# EAGLE schematic out8x8_2 (EAGLE 9.6.2)
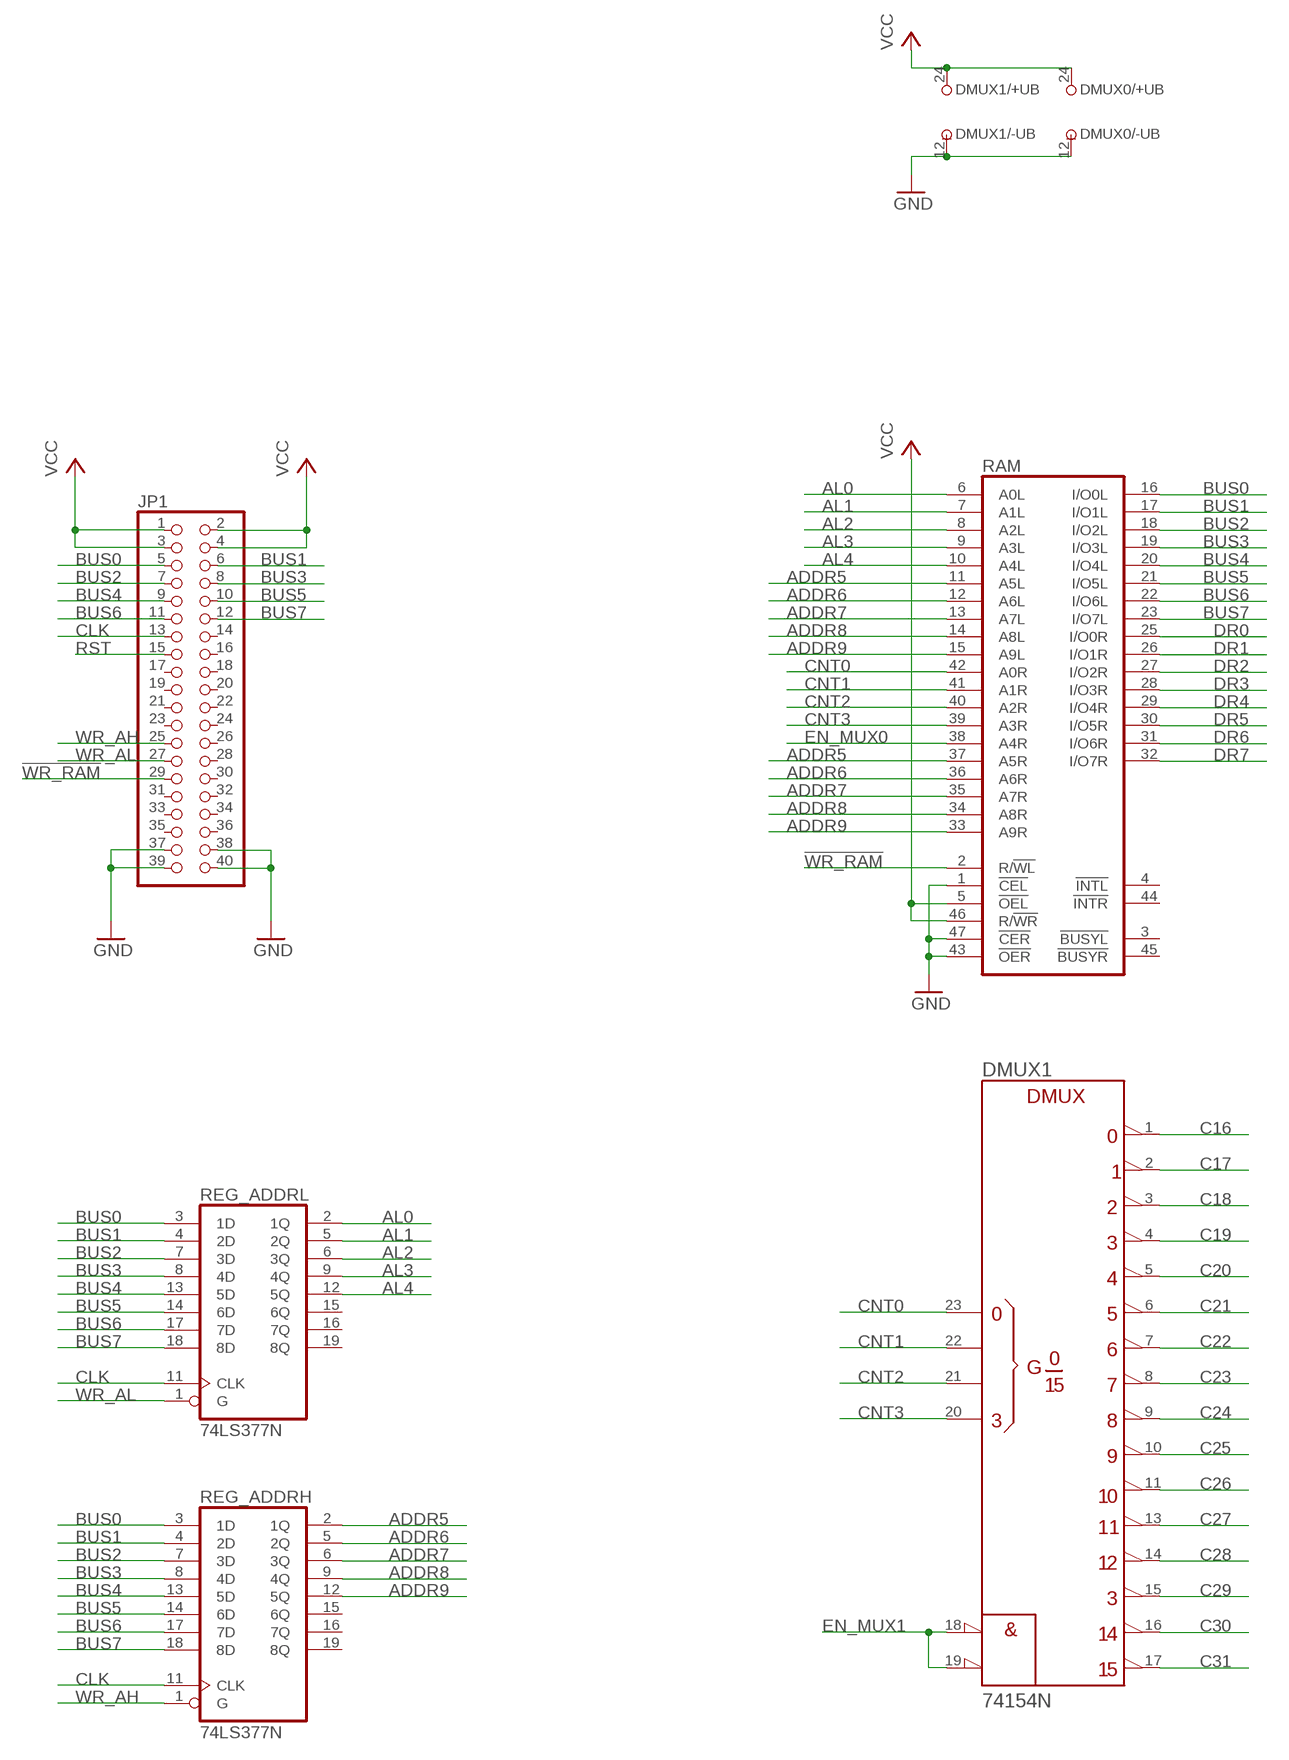
[diagram p0: schematic, sheet 1, part 1 of 2]
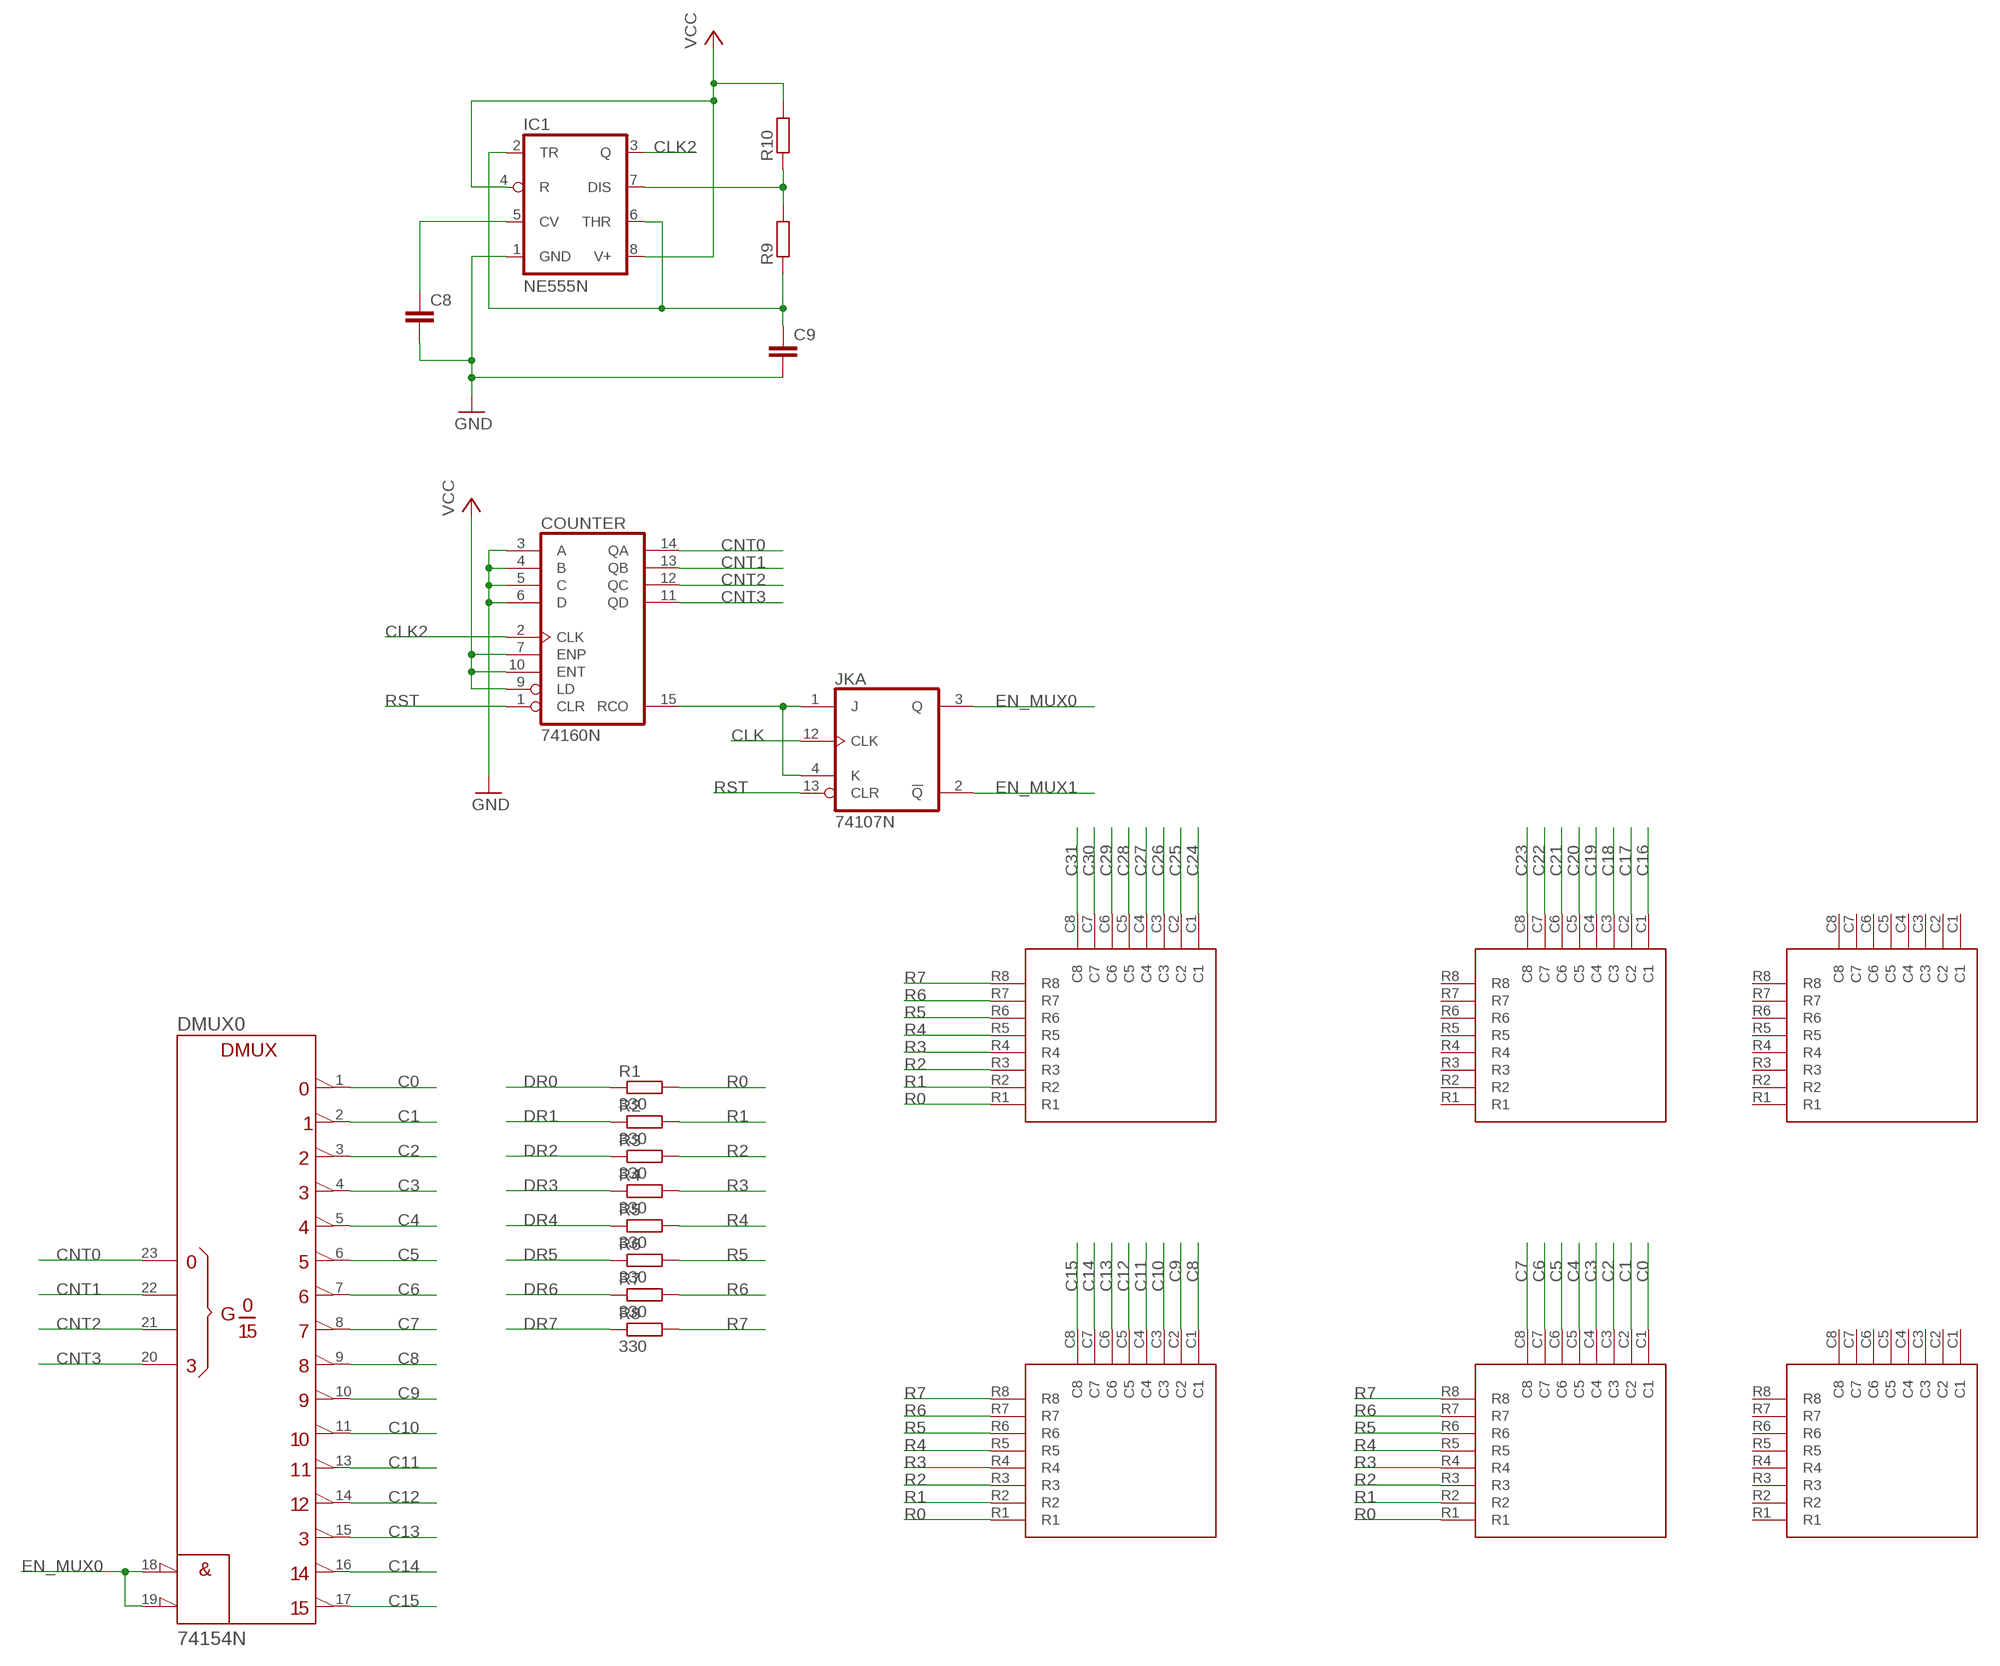
[diagram p1: schematic, sheet 1, part 2 of 2]

## Parts
C8  C-EUC1206K  [C1206K]
C9  C-EUC1206K  [C1206K]
COUNTER  74160N  [DIL16]
DMUX0  74154N  [DIL24-3]
DMUX1  74154N  [DIL24-3]
IC1  NE555N  [DIL08]
JK  74107N  [DIL14]
JP1  PINHD-2X20/90  [2X20/90]
R1  330  R-EU_R0805  [R0805]
R2  330  R-EU_R0805  [R0805]
R3  330  R-EU_R0805  [R0805]
R4  330  R-EU_R0805  [R0805]
R5  330  R-EU_R0805  [R0805]
R6  330  R-EU_R0805  [R0805]
R7  330  R-EU_R0805  [R0805]
R8  330  R-EU_R0805  [R0805]
R9  R-EU_M1206  [M1206]
R10  R-EU_M1206  [M1206]
RAM  7130P  [DIL48]
REG_ADDRH  74LS377N  [DIL20]
REG_ADDRL  74LS377N  [DIL20]
U$1  LED8X8  [LED8X8]
U$2  LED8X8  [LED8X8]
U$3  LED8X8  [LED8X8]
U$4  LED8X8  [LED8X8]
U$5  LED8X8  [LED8X8]
U$6  LED8X8  [LED8X8]

## Nets
!WR_RAM: JP1.29 RAM.2(R/!WL)
ADDR5: RAM.11(A5L) RAM.37(A5R) REG_ADDRH.2(1Q)
ADDR6: RAM.12(A6L) RAM.36(A6R) REG_ADDRH.5(2Q)
ADDR7: RAM.13(A7L) RAM.35(A7R) REG_ADDRH.6(3Q)
ADDR8: RAM.14(A8L) RAM.34(A8R) REG_ADDRH.9(4Q)
ADDR9: RAM.15(A9L) RAM.33(A9R) REG_ADDRH.12(5Q)
AL0: RAM.6(A0L) REG_ADDRL.2(1Q)
AL1: RAM.7(A1L) REG_ADDRL.5(2Q)
AL2: RAM.8(A2L) REG_ADDRL.6(3Q)
AL3: RAM.9(A3L) REG_ADDRL.9(4Q)
AL4: RAM.10(A4L) REG_ADDRL.12(5Q)
BUS0: JP1.5 RAM.16(I/O0L) REG_ADDRH.3(1D) REG_ADDRL.3(1D)
BUS1: JP1.6 RAM.17(I/O1L) REG_ADDRH.4(2D) REG_ADDRL.4(2D)
BUS2: JP1.7 RAM.18(I/O2L) REG_ADDRH.7(3D) REG_ADDRL.7(3D)
BUS3: JP1.8 RAM.19(I/O3L) REG_ADDRH.8(4D) REG_ADDRL.8(4D)
BUS4: JP1.9 RAM.20(I/O4L) REG_ADDRH.13(5D) REG_ADDRL.13(5D)
BUS5: JP1.10 RAM.21(I/O5L) REG_ADDRH.14(6D) REG_ADDRL.14(6D)
BUS6: JP1.11 RAM.22(I/O6L) REG_ADDRH.17(7D) REG_ADDRL.17(7D)
BUS7: JP1.12 RAM.23(I/O7L) REG_ADDRH.18(8D) REG_ADDRL.18(8D)
C0: DMUX0.1 U$4.C1
C1: DMUX0.2 U$4.C2
C2: DMUX0.3 U$4.C3
C3: DMUX0.4 U$4.C4
C4: DMUX0.5 U$4.C5
C5: DMUX0.6 U$4.C6
C6: DMUX0.7 U$4.C7
C7: DMUX0.8 U$4.C8
C8: DMUX0.9 U$3.C1
C9: DMUX0.10 U$3.C2
C10: DMUX0.11 U$3.C3
C11: DMUX0.13 U$3.C4
C12: DMUX0.14 U$3.C5
C13: DMUX0.15 U$3.C6
C14: DMUX0.16 U$3.C7
C15: DMUX0.17 U$3.C8
C16: DMUX1.1 U$1.C1
C17: DMUX1.2 U$1.C2
C18: DMUX1.3 U$1.C3
C19: DMUX1.4 U$1.C4
C20: DMUX1.5 U$1.C5
C21: DMUX1.6 U$1.C6
C22: DMUX1.7 U$1.C7
C23: DMUX1.8 U$1.C8
C24: DMUX1.9 U$2.C1
C25: DMUX1.10 U$2.C2
C26: DMUX1.11 U$2.C3
C27: DMUX1.13 U$2.C4
C28: DMUX1.14 U$2.C5
C29: DMUX1.15 U$2.C6
C30: DMUX1.16 U$2.C7
C31: DMUX1.17 U$2.C8
CLK: JK.12(A:CLK) JP1.13 REG_ADDRH.11(CLK) REG_ADDRL.11(CLK)
CLK2: COUNTER.2(CLK) IC1.3(Q)
CNT0: COUNTER.14(QA) DMUX0.23(A) DMUX1.23(A) RAM.42(A0R)
CNT1: COUNTER.13(QB) DMUX0.22(B) DMUX1.22(B) RAM.41(A1R)
CNT2: COUNTER.12(QC) DMUX0.21(C) DMUX1.21(C) RAM.40(A2R)
CNT3: COUNTER.11(QD) DMUX0.20(D) DMUX1.20(D) RAM.39(A3R)
DR0: R1.1 RAM.25(I/O0R)
DR1: R2.1 RAM.26(I/O1R)
DR2: R3.1 RAM.27(I/O2R)
DR3: R4.1 RAM.28(I/O3R)
DR4: R5.1 RAM.29(I/O4R)
DR5: R6.1 RAM.30(I/O5R)
DR6: R7.1 RAM.31(I/O6R)
DR7: R8.1 RAM.32(I/O7R)
EN_MUX0: DMUX0.18(!G1) DMUX0.19(!G2) JK.3(A:Q) RAM.38(A4R)
EN_MUX1: DMUX1.18(!G1) DMUX1.19(!G2) JK.2(A:!Q)
GND: C8.2 C9.2 COUNTER.3(A) COUNTER.4(B) COUNTER.5(C) COUNTER.6(D) DMUX0.12(-UB) DMUX1.12(-UB) IC1.1(GND) JP1.37 JP1.38 JP1.39 JP1.40 RAM.1(!CEL) RAM.43(!OER) RAM.47(!CER)
N$1: COUNTER.15(RCO) JK.1(A:J) JK.4(A:K)
N$33: IC1.7(DIS) R9.2 R10.1
N$34: C8.1 IC1.5(CV)
N$36: C9.1 IC1.2(TR) IC1.6(THR) R9.1
R0: R1.2 U$2.R1 U$3.R1 U$4.R1
R1: R2.2 U$2.R2 U$3.R2 U$4.R2
R2: R3.2 U$2.R3 U$3.R3 U$4.R3
R3: R4.2 U$2.R4 U$3.R4 U$4.R4
R4: R5.2 U$2.R5 U$3.R5 U$4.R5
R5: R6.2 U$2.R6 U$3.R6 U$4.R6
R6: R7.2 U$2.R7 U$3.R7 U$4.R7
R7: R8.2 U$2.R8 U$3.R8 U$4.R8
RST: COUNTER.1(CLR) JK.13(A:CLR) JP1.15
VCC: COUNTER.7(ENP) COUNTER.9(LD) COUNTER.10(ENT) DMUX0.24(+UB) DMUX1.24(+UB) IC1.4(R) IC1.8(V+) JP1.1 JP1.2 JP1.3 JP1.4 R10.2 RAM.5(!OEL) RAM.46(R/!WR)
WR_AH: JP1.25 REG_ADDRH.1(G)
WR_AL: JP1.27 REG_ADDRL.1(G)
Unconnected: JK.5(B:Q) JK.6(B:!Q) JK.8(B:J) JK.9(B:CLK) JK.10(B:CLR) JK.11(B:K) JP1.14 JP1.16 JP1.17 JP1.18 JP1.19 JP1.20 JP1.21 JP1.22 JP1.23 JP1.24 JP1.26 JP1.28 JP1.30 JP1.31 JP1.32 JP1.33 JP1.34 JP1.35 JP1.36 RAM.3(!BUSYL) RAM.4(!INTL) RAM.44(!INTR) RAM.45(!BUSYR) REG_ADDRH.15(6Q) REG_ADDRH.16(7Q) REG_ADDRH.19(8Q) REG_ADDRL.15(6Q) REG_ADDRL.16(7Q) REG_ADDRL.19(8Q) U$1.R1 U$1.R2 U$1.R3 U$1.R4 U$1.R5 U$1.R6 U$1.R7 U$1.R8 U$5.C1 U$5.C2 U$5.C3 U$5.C4 U$5.C5 U$5.C6 U$5.C7 U$5.C8 U$5.R1 U$5.R2 U$5.R3 U$5.R4 U$5.R5 U$5.R6 U$5.R7 U$5.R8 U$6.C1 U$6.C2 U$6.C3 U$6.C4 U$6.C5 U$6.C6 U$6.C7 U$6.C8 U$6.R1 U$6.R2 U$6.R3 U$6.R4 U$6.R5 U$6.R6 U$6.R7 U$6.R8

## Power pins joined to a net without a drawn wire
GND: COUNTER.8(GND) JK.7(P:GND) RAM.24(GND) REG_ADDRH.10(GND) REG_ADDRL.10(GND)
VCC: COUNTER.16(VCC) JK.14(P:VCC) RAM.48(VCC) REG_ADDRH.20(VCC) REG_ADDRL.20(VCC)

## Library data of the parts
C8 C9 = rcl:C-EU: CAPACITOR, European symbol; SPICEPREFIX: C
COUNTER = 74xx-eu:74*160: Synchronous 4-bit COUNTER
DMUX0 DMUX1 = 74ttl-din:74*154: 4-line to 16-line data SELECTOR/MULTIPLEXER
IC1 = linear:*555: TIMER
JK = 74xx-eu:74*107: Dual J-K FLIP FLOP, clear
JP1 = pinhead:PINHD-2X20: PIN HEADER
R1-R10 = rcl:R-EU_: RESISTOR, European symbol; SPICEPREFIX: R
RAM = memory-idt:7130P: MEMORY; OC_FARNELL: unknown; OC_NEWARK: unknown
REG_ADDRH REG_ADDRL = 74xx-eu:74*377: Octal D type FLIP FLOP, enable
U$1-U$6 = IsaacAlonso:LED8X8